# Altium schematic sheet 00_CONNECTORS.SchDoc
size A4; SheetNumber: 0
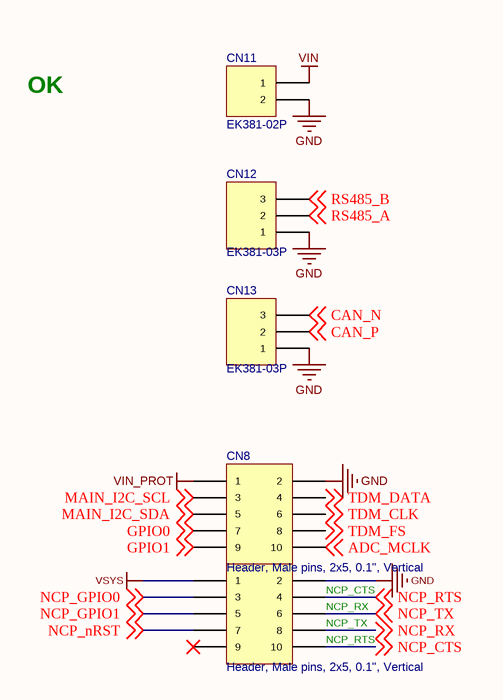
[diagram p0: 00_CONNECTORS.SchDoc]

## Parts
CN8  Header, Male pins, 2x5, 0.1", Vertical
CN9  Header, Male pins, 2x5, 0.1", Vertical
CN11  EK381-02P  [EK381-02P]
CN12  EK381-03P  [EK381-03P]
CN13  EK381-03P  [EK381-03P]

## Nets
GND: CN8.2 CN9.2 CN11.2L(2) CN12.1L(1) CN13.1L(1)
VIN: CN11.1L(1)
VIN_PROT: CN8.1
VSYS: CN9.1
ADC_MCLK: CN8.10 ; off-sheet ADC_MCLK
CAN_N: CN13.3L(3) ; off-sheet CAN_N
CAN_P: CN13.2L(2) ; off-sheet CAN_P
GPIO0: CN8.7 ; off-sheet GPIO0
GPIO1: CN8.9 ; off-sheet GPIO1
MAIN_I2C_SCL: CN8.3 ; off-sheet MAIN_I2C_SCL
MAIN_I2C_SDA: CN8.5 ; off-sheet MAIN_I2C_SDA
NCP_CTS: CN9.10 ; off-sheet NCP_CTS
NCP_GPIO0: CN9.3 ; off-sheet NCP_GPIO0
NCP_GPIO1: CN9.5 ; off-sheet NCP_GPIO1
NCP_nRST: CN9.7 ; off-sheet NCP_nRST
NCP_RTS: CN9.4 ; off-sheet NCP_RTS
NCP_RX: CN9.8 ; off-sheet NCP_RX
NCP_TX: CN9.6 ; off-sheet NCP_TX
RS485_A: CN12.2L(2) ; off-sheet RS485_A
RS485_B: CN12.3L(3) ; off-sheet RS485_B
TDM_CLK: CN8.6 ; off-sheet TDM_CLK
TDM_DATA: CN8.4 ; off-sheet TDM_DATA
TDM_FS: CN8.8 ; off-sheet TDM_FS

Not connected (* = marked no-connect by the designer): CN9 9*

## Notes on the sheet
- OK
- (near CN9) NCP_TX
- (near CN9) NCP_RX
- NCP_CTS
- (near CN9) NCP_RTS

## Library data of the parts
CN8 CN9 = Header 5X2: Symbol Checked: Ok; MFG: <GENERIC>; Replacement Allowed: Yes; Footprint Checked: Assign OK, Footprint OK; MFG_PN: <GENERIC>; FP_DESC: Header, Male pins, 2x5, 0.1", Vertical
CN11 = Header 2: Terminal block, 3.81mm, 2-Pin; MFG: DINKLE; Symbol Checked: Ok; Replacement Allowed: Ask; Footprint Checked: Assign OK, Footprint OK; FP_DESC: Terminal block, 3.81mm, 2-Pin; MFG_PN: EK381-02P
CN12 CN13 = Header 3: Terminal block, 3.81mm, 3-Pin; MFG: DINKLE; Symbol Checked: Ok; Replacement Allowed: Ask; Footprint Checked: Assign OK, Footprint OK; FP_DESC: Terminal block, 3.81mm, 3-Pin; MFG_PN: EK381-03P